# Altium schematic sheet SS_24.SchDoc
size A2
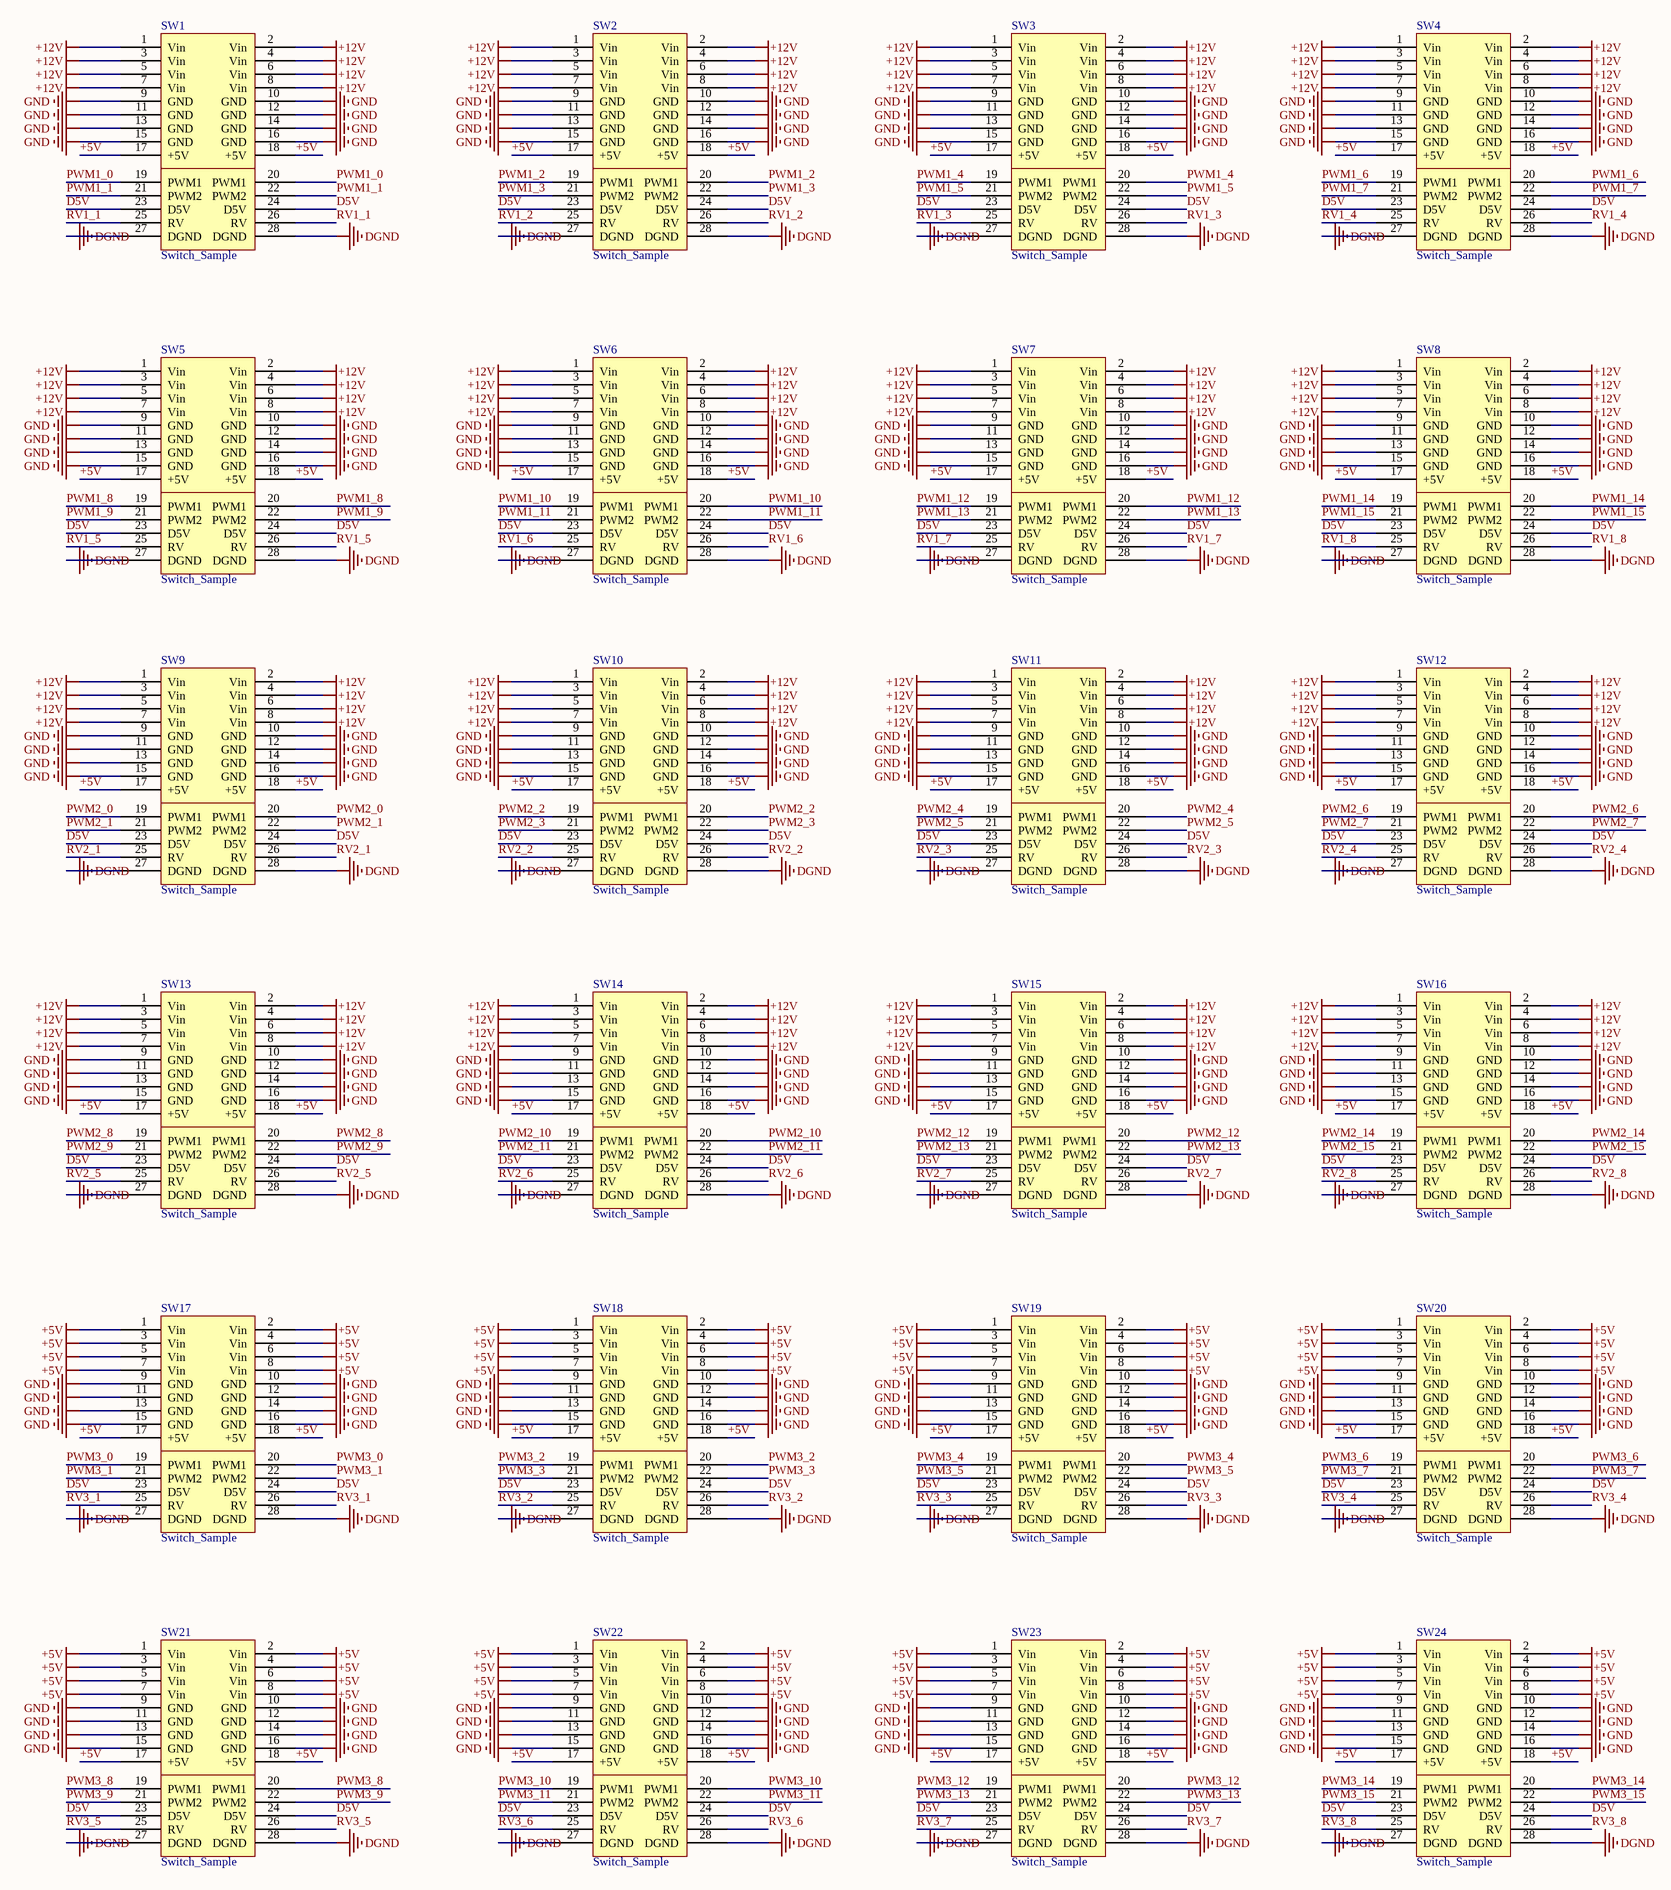
[diagram p0: SS_24.SchDoc]

## Parts
SW1  Switch_Sample  [Switch_Sample]
SW2  Switch_Sample  [Switch_Sample]
SW3  Switch_Sample  [Switch_Sample]
SW4  Switch_Sample  [Switch_Sample]
SW5  Switch_Sample  [Switch_Sample]
SW6  Switch_Sample  [Switch_Sample]
SW7  Switch_Sample  [Switch_Sample]
SW8  Switch_Sample  [Switch_Sample]
SW9  Switch_Sample  [Switch_Sample]
SW10  Switch_Sample  [Switch_Sample]
SW11  Switch_Sample  [Switch_Sample]
SW12  Switch_Sample  [Switch_Sample]
SW13  Switch_Sample  [Switch_Sample]
SW14  Switch_Sample  [Switch_Sample]
SW15  Switch_Sample  [Switch_Sample]
SW16  Switch_Sample  [Switch_Sample]
SW17  Switch_Sample  [Switch_Sample]
SW18  Switch_Sample  [Switch_Sample]
SW19  Switch_Sample  [Switch_Sample]
SW20  Switch_Sample  [Switch_Sample]
SW21  Switch_Sample  [Switch_Sample]
SW22  Switch_Sample  [Switch_Sample]
SW23  Switch_Sample  [Switch_Sample]
SW24  Switch_Sample  [Switch_Sample]

## Nets
+5V: SW1.17(+5V) SW1.18(+5V) SW2.17(+5V) SW2.18(+5V) SW3.17(+5V) SW3.18(+5V) SW4.17(+5V) SW4.18(+5V) SW5.17(+5V) SW5.18(+5V) SW6.17(+5V) SW6.18(+5V) SW7.17(+5V) SW7.18(+5V) SW8.17(+5V) SW8.18(+5V) SW9.17(+5V) SW9.18(+5V) SW10.17(+5V) SW10.18(+5V) SW11.17(+5V) SW11.18(+5V) SW12.17(+5V) SW12.18(+5V) SW13.17(+5V) SW13.18(+5V) SW14.17(+5V) SW14.18(+5V) SW15.17(+5V) SW15.18(+5V) SW16.17(+5V) SW16.18(+5V) SW17.1(Vin) SW17.2(Vin) SW17.3(Vin) SW17.4(Vin) SW17.5(Vin) SW17.6(Vin) SW17.7(Vin) SW17.8(Vin) SW17.17(+5V) SW17.18(+5V) SW18.1(Vin) SW18.2(Vin) SW18.3(Vin) SW18.4(Vin) SW18.5(Vin) SW18.6(Vin) SW18.7(Vin) SW18.8(Vin) SW18.17(+5V) SW18.18(+5V) SW19.1(Vin) SW19.2(Vin) SW19.3(Vin) SW19.4(Vin) SW19.5(Vin) SW19.6(Vin) SW19.7(Vin) SW19.8(Vin) SW19.17(+5V) SW19.18(+5V) SW20.1(Vin) SW20.2(Vin) SW20.3(Vin) SW20.4(Vin) SW20.5(Vin) SW20.6(Vin) SW20.7(Vin) SW20.8(Vin) SW20.17(+5V) SW20.18(+5V) SW21.1(Vin) SW21.2(Vin) SW21.3(Vin) SW21.4(Vin) SW21.5(Vin) SW21.6(Vin) SW21.7(Vin) SW21.8(Vin) SW21.17(+5V) SW21.18(+5V) SW22.1(Vin) SW22.2(Vin) SW22.3(Vin) SW22.4(Vin) SW22.5(Vin) SW22.6(Vin) SW22.7(Vin) SW22.8(Vin) SW22.17(+5V) SW22.18(+5V) SW23.1(Vin) SW23.2(Vin) SW23.3(Vin) SW23.4(Vin) SW23.5(Vin) SW23.6(Vin) SW23.7(Vin) SW23.8(Vin) SW23.17(+5V) SW23.18(+5V) SW24.1(Vin) SW24.2(Vin) SW24.3(Vin) SW24.4(Vin) SW24.5(Vin) SW24.6(Vin) SW24.7(Vin) SW24.8(Vin) SW24.17(+5V) SW24.18(+5V)
+12V: SW1.1(Vin) SW1.2(Vin) SW1.3(Vin) SW1.4(Vin) SW1.5(Vin) SW1.6(Vin) SW1.7(Vin) SW1.8(Vin) SW2.1(Vin) SW2.2(Vin) SW2.3(Vin) SW2.4(Vin) SW2.5(Vin) SW2.6(Vin) SW2.7(Vin) SW2.8(Vin) SW3.1(Vin) SW3.2(Vin) SW3.3(Vin) SW3.4(Vin) SW3.5(Vin) SW3.6(Vin) SW3.7(Vin) SW3.8(Vin) SW4.1(Vin) SW4.2(Vin) SW4.3(Vin) SW4.4(Vin) SW4.5(Vin) SW4.6(Vin) SW4.7(Vin) SW4.8(Vin) SW5.1(Vin) SW5.2(Vin) SW5.3(Vin) SW5.4(Vin) SW5.5(Vin) SW5.6(Vin) SW5.7(Vin) SW5.8(Vin) SW6.1(Vin) SW6.2(Vin) SW6.3(Vin) SW6.4(Vin) SW6.5(Vin) SW6.6(Vin) SW6.7(Vin) SW6.8(Vin) SW7.1(Vin) SW7.2(Vin) SW7.3(Vin) SW7.4(Vin) SW7.5(Vin) SW7.6(Vin) SW7.7(Vin) SW7.8(Vin) SW8.1(Vin) SW8.2(Vin) SW8.3(Vin) SW8.4(Vin) SW8.5(Vin) SW8.6(Vin) SW8.7(Vin) SW8.8(Vin) SW9.1(Vin) SW9.2(Vin) SW9.3(Vin) SW9.4(Vin) SW9.5(Vin) SW9.6(Vin) SW9.7(Vin) SW9.8(Vin) SW10.1(Vin) SW10.2(Vin) SW10.3(Vin) SW10.4(Vin) SW10.5(Vin) SW10.6(Vin) SW10.7(Vin) SW10.8(Vin) SW11.1(Vin) SW11.2(Vin) SW11.3(Vin) SW11.4(Vin) SW11.5(Vin) SW11.6(Vin) SW11.7(Vin) SW11.8(Vin) SW12.1(Vin) SW12.2(Vin) SW12.3(Vin) SW12.4(Vin) SW12.5(Vin) SW12.6(Vin) SW12.7(Vin) SW12.8(Vin) SW13.1(Vin) SW13.2(Vin) SW13.3(Vin) SW13.4(Vin) SW13.5(Vin) SW13.6(Vin) SW13.7(Vin) SW13.8(Vin) SW14.1(Vin) SW14.2(Vin) SW14.3(Vin) SW14.4(Vin) SW14.5(Vin) SW14.6(Vin) SW14.7(Vin) SW14.8(Vin) SW15.1(Vin) SW15.2(Vin) SW15.3(Vin) SW15.4(Vin) SW15.5(Vin) SW15.6(Vin) SW15.7(Vin) SW15.8(Vin) SW16.1(Vin) SW16.2(Vin) SW16.3(Vin) SW16.4(Vin) SW16.5(Vin) SW16.6(Vin) SW16.7(Vin) SW16.8(Vin)
DGND: SW1.27(DGND) SW1.28(DGND) SW2.27(DGND) SW2.28(DGND) SW3.27(DGND) SW3.28(DGND) SW4.27(DGND) SW4.28(DGND) SW5.27(DGND) SW5.28(DGND) SW6.27(DGND) SW6.28(DGND) SW7.27(DGND) SW7.28(DGND) SW8.27(DGND) SW8.28(DGND) SW9.27(DGND) SW9.28(DGND) SW10.27(DGND) SW10.28(DGND) SW11.27(DGND) SW11.28(DGND) SW12.27(DGND) SW12.28(DGND) SW13.27(DGND) SW13.28(DGND) SW14.27(DGND) SW14.28(DGND) SW15.27(DGND) SW15.28(DGND) SW16.27(DGND) SW16.28(DGND) SW17.27(DGND) SW17.28(DGND) SW18.27(DGND) SW18.28(DGND) SW19.27(DGND) SW19.28(DGND) SW20.27(DGND) SW20.28(DGND) SW21.27(DGND) SW21.28(DGND) SW22.27(DGND) SW22.28(DGND) SW23.27(DGND) SW23.28(DGND) SW24.27(DGND) SW24.28(DGND)
GND: SW1.9(GND) SW1.10(GND) SW1.11(GND) SW1.12(GND) SW1.13(GND) SW1.14(GND) SW1.15(GND) SW1.16(GND) SW2.9(GND) SW2.10(GND) SW2.11(GND) SW2.12(GND) SW2.13(GND) SW2.14(GND) SW2.15(GND) SW2.16(GND) SW3.9(GND) SW3.10(GND) SW3.11(GND) SW3.12(GND) SW3.13(GND) SW3.14(GND) SW3.15(GND) SW3.16(GND) SW4.9(GND) SW4.10(GND) SW4.11(GND) SW4.12(GND) SW4.13(GND) SW4.14(GND) SW4.15(GND) SW4.16(GND) SW5.9(GND) SW5.10(GND) SW5.11(GND) SW5.12(GND) SW5.13(GND) SW5.14(GND) SW5.15(GND) SW5.16(GND) SW6.9(GND) SW6.10(GND) SW6.11(GND) SW6.12(GND) SW6.13(GND) SW6.14(GND) SW6.15(GND) SW6.16(GND) SW7.9(GND) SW7.10(GND) SW7.11(GND) SW7.12(GND) SW7.13(GND) SW7.14(GND) SW7.15(GND) SW7.16(GND) SW8.9(GND) SW8.10(GND) SW8.11(GND) SW8.12(GND) SW8.13(GND) SW8.14(GND) SW8.15(GND) SW8.16(GND) SW9.9(GND) SW9.10(GND) SW9.11(GND) SW9.12(GND) SW9.13(GND) SW9.14(GND) SW9.15(GND) SW9.16(GND) SW10.9(GND) SW10.10(GND) SW10.11(GND) SW10.12(GND) SW10.13(GND) SW10.14(GND) SW10.15(GND) SW10.16(GND) SW11.9(GND) SW11.10(GND) SW11.11(GND) SW11.12(GND) SW11.13(GND) SW11.14(GND) SW11.15(GND) SW11.16(GND) SW12.9(GND) SW12.10(GND) SW12.11(GND) SW12.12(GND) SW12.13(GND) SW12.14(GND) SW12.15(GND) SW12.16(GND) SW13.9(GND) SW13.10(GND) SW13.11(GND) SW13.12(GND) SW13.13(GND) SW13.14(GND) SW13.15(GND) SW13.16(GND) SW14.9(GND) SW14.10(GND) SW14.11(GND) SW14.12(GND) SW14.13(GND) SW14.14(GND) SW14.15(GND) SW14.16(GND) SW15.9(GND) SW15.10(GND) SW15.11(GND) SW15.12(GND) SW15.13(GND) SW15.14(GND) SW15.15(GND) SW15.16(GND) SW16.9(GND) SW16.10(GND) SW16.11(GND) SW16.12(GND) SW16.13(GND) SW16.14(GND) SW16.15(GND) SW16.16(GND) SW17.9(GND) SW17.10(GND) SW17.11(GND) SW17.12(GND) SW17.13(GND) SW17.14(GND) SW17.15(GND) SW17.16(GND) SW18.9(GND) SW18.10(GND) SW18.11(GND) SW18.12(GND) SW18.13(GND) SW18.14(GND) SW18.15(GND) SW18.16(GND) SW19.9(GND) SW19.10(GND) SW19.11(GND) SW19.12(GND) SW19.13(GND) SW19.14(GND) SW19.15(GND) SW19.16(GND) SW20.9(GND) SW20.10(GND) SW20.11(GND) SW20.12(GND) SW20.13(GND) SW20.14(GND) SW20.15(GND) SW20.16(GND) SW21.9(GND) SW21.10(GND) SW21.11(GND) SW21.12(GND) SW21.13(GND) SW21.14(GND) SW21.15(GND) SW21.16(GND) SW22.9(GND) SW22.10(GND) SW22.11(GND) SW22.12(GND) SW22.13(GND) SW22.14(GND) SW22.15(GND) SW22.16(GND) SW23.9(GND) SW23.10(GND) SW23.11(GND) SW23.12(GND) SW23.13(GND) SW23.14(GND) SW23.15(GND) SW23.16(GND) SW24.9(GND) SW24.10(GND) SW24.11(GND) SW24.12(GND) SW24.13(GND) SW24.14(GND) SW24.15(GND) SW24.16(GND)
D5V: SW1.23(D5V) SW1.24(D5V) SW2.23(D5V) SW2.24(D5V) SW3.23(D5V) SW3.24(D5V) SW4.23(D5V) SW4.24(D5V) SW5.23(D5V) SW5.24(D5V) SW6.23(D5V) SW6.24(D5V) SW7.23(D5V) SW7.24(D5V) SW8.23(D5V) SW8.24(D5V) SW9.23(D5V) SW9.24(D5V) SW10.23(D5V) SW10.24(D5V) SW11.23(D5V) SW11.24(D5V) SW12.23(D5V) SW12.24(D5V) SW13.23(D5V) SW13.24(D5V) SW14.23(D5V) SW14.24(D5V) SW15.23(D5V) SW15.24(D5V) SW16.23(D5V) SW16.24(D5V) SW17.23(D5V) SW17.24(D5V) SW18.23(D5V) SW18.24(D5V) SW19.23(D5V) SW19.24(D5V) SW20.23(D5V) SW20.24(D5V) SW21.23(D5V) SW21.24(D5V) SW22.23(D5V) SW22.24(D5V) SW23.23(D5V) SW23.24(D5V) SW24.23(D5V) SW24.24(D5V)
PWM1_0: SW1.19(PWM1) SW1.20(PWM1)
PWM1_1: SW1.21(PWM2) SW1.22(PWM2)
PWM1_2: SW2.19(PWM1) SW2.20(PWM1)
PWM1_3: SW2.21(PWM2) SW2.22(PWM2)
PWM1_4: SW3.19(PWM1) SW3.20(PWM1)
PWM1_5: SW3.21(PWM2) SW3.22(PWM2)
PWM1_6: SW4.19(PWM1) SW4.20(PWM1)
PWM1_7: SW4.21(PWM2) SW4.22(PWM2)
PWM1_8: SW5.19(PWM1) SW5.20(PWM1)
PWM1_9: SW5.21(PWM2) SW5.22(PWM2)
PWM1_10: SW6.19(PWM1) SW6.20(PWM1)
PWM1_11: SW6.21(PWM2) SW6.22(PWM2)
PWM1_12: SW7.19(PWM1) SW7.20(PWM1)
PWM1_13: SW7.21(PWM2) SW7.22(PWM2)
PWM1_14: SW8.19(PWM1) SW8.20(PWM1)
PWM1_15: SW8.21(PWM2) SW8.22(PWM2)
PWM2_0: SW9.19(PWM1) SW9.20(PWM1)
PWM2_1: SW9.21(PWM2) SW9.22(PWM2)
PWM2_2: SW10.19(PWM1) SW10.20(PWM1)
PWM2_3: SW10.21(PWM2) SW10.22(PWM2)
PWM2_4: SW11.19(PWM1) SW11.20(PWM1)
PWM2_5: SW11.21(PWM2) SW11.22(PWM2)
PWM2_6: SW12.19(PWM1) SW12.20(PWM1)
PWM2_7: SW12.21(PWM2) SW12.22(PWM2)
PWM2_8: SW13.19(PWM1) SW13.20(PWM1)
PWM2_9: SW13.21(PWM2) SW13.22(PWM2)
PWM2_10: SW14.19(PWM1) SW14.20(PWM1)
PWM2_11: SW14.21(PWM2) SW14.22(PWM2)
PWM2_12: SW15.19(PWM1) SW15.20(PWM1)
PWM2_13: SW15.21(PWM2) SW15.22(PWM2)
PWM2_14: SW16.19(PWM1) SW16.20(PWM1)
PWM2_15: SW16.21(PWM2) SW16.22(PWM2)
PWM3_0: SW17.19(PWM1) SW17.20(PWM1)
PWM3_1: SW17.21(PWM2) SW17.22(PWM2)
PWM3_2: SW18.19(PWM1) SW18.20(PWM1)
PWM3_3: SW18.21(PWM2) SW18.22(PWM2)
PWM3_4: SW19.19(PWM1) SW19.20(PWM1)
PWM3_5: SW19.21(PWM2) SW19.22(PWM2)
PWM3_6: SW20.19(PWM1) SW20.20(PWM1)
PWM3_7: SW20.21(PWM2) SW20.22(PWM2)
PWM3_8: SW21.19(PWM1) SW21.20(PWM1)
PWM3_9: SW21.21(PWM2) SW21.22(PWM2)
PWM3_10: SW22.19(PWM1) SW22.20(PWM1)
PWM3_11: SW22.21(PWM2) SW22.22(PWM2)
PWM3_12: SW23.19(PWM1) SW23.20(PWM1)
PWM3_13: SW23.21(PWM2) SW23.22(PWM2)
PWM3_14: SW24.19(PWM1) SW24.20(PWM1)
PWM3_15: SW24.21(PWM2) SW24.22(PWM2)
RV1_1: SW1.25(RV) SW1.26(RV)
RV1_2: SW2.25(RV) SW2.26(RV)
RV1_3: SW3.25(RV) SW3.26(RV)
RV1_4: SW4.25(RV) SW4.26(RV)
RV1_5: SW5.25(RV) SW5.26(RV)
RV1_6: SW6.25(RV) SW6.26(RV)
RV1_7: SW7.25(RV) SW7.26(RV)
RV1_8: SW8.25(RV) SW8.26(RV)
RV2_1: SW9.25(RV) SW9.26(RV)
RV2_2: SW10.25(RV) SW10.26(RV)
RV2_3: SW11.25(RV) SW11.26(RV)
RV2_4: SW12.25(RV) SW12.26(RV)
RV2_5: SW13.25(RV) SW13.26(RV)
RV2_6: SW14.25(RV) SW14.26(RV)
RV2_7: SW15.25(RV) SW15.26(RV)
RV2_8: SW16.25(RV) SW16.26(RV)
RV3_1: SW17.25(RV) SW17.26(RV)
RV3_2: SW18.25(RV) SW18.26(RV)
RV3_3: SW19.25(RV) SW19.26(RV)
RV3_4: SW20.25(RV) SW20.26(RV)
RV3_5: SW21.25(RV) SW21.26(RV)
RV3_6: SW22.25(RV) SW22.26(RV)
RV3_7: SW23.25(RV) SW23.26(RV)
RV3_8: SW24.25(RV) SW24.26(RV)